# Altium schematic sheet FT4232H-USB to UART.SchDoc
size A3
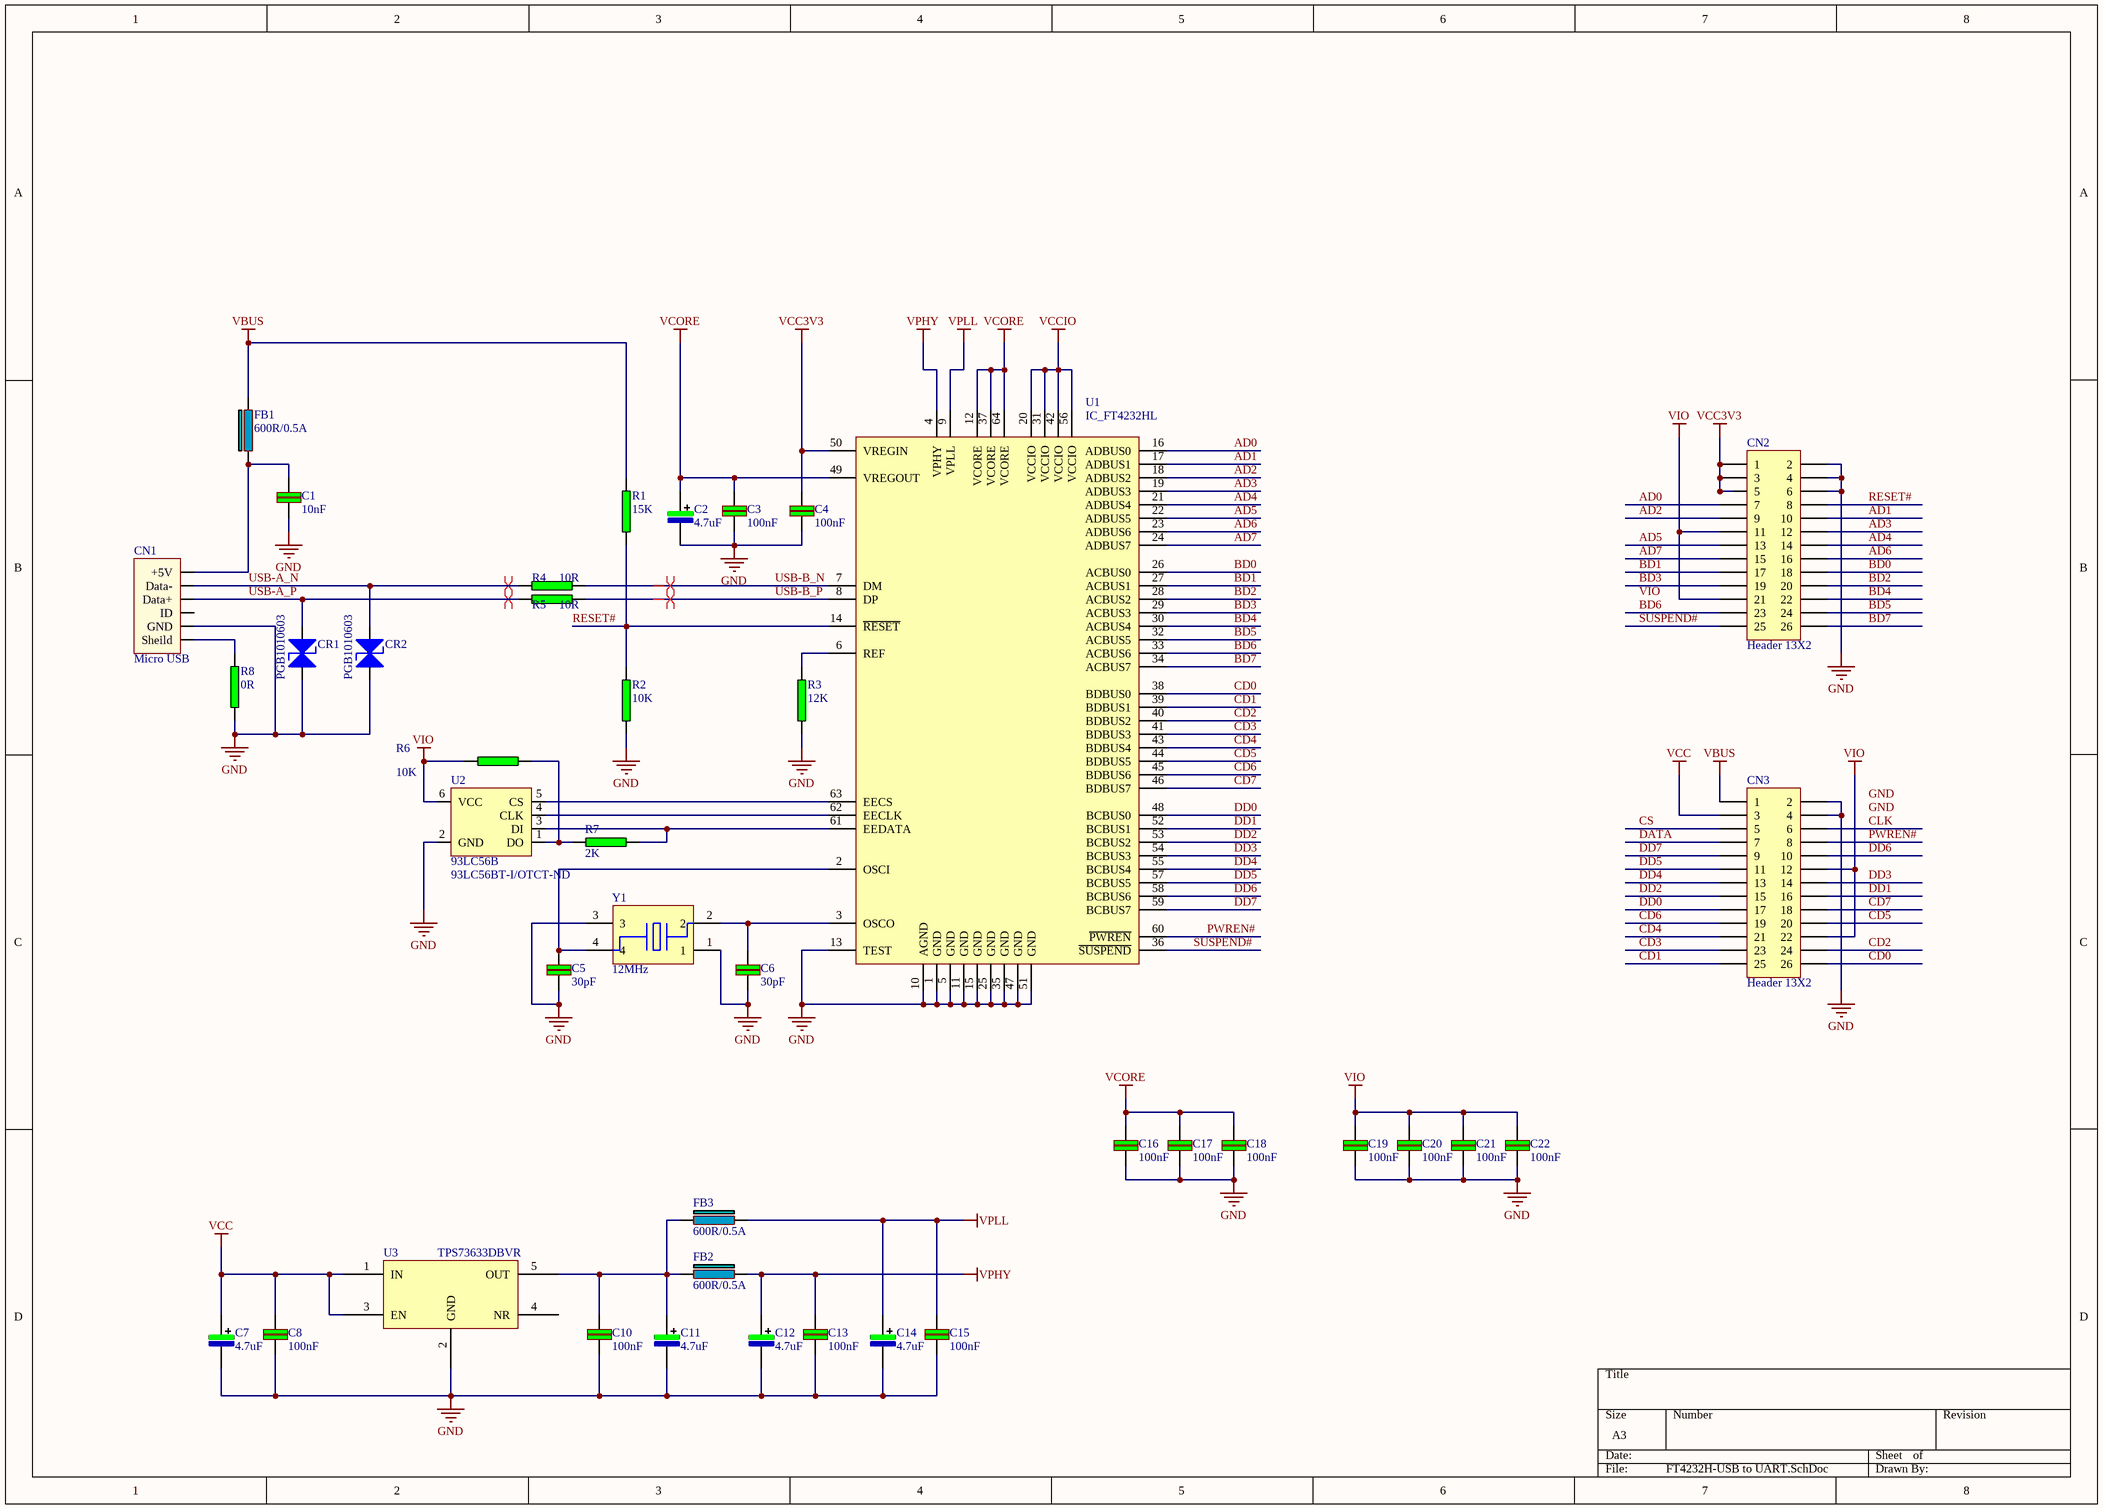
[diagram p0: FT4232H-USB to UART.SchDoc]

## Parts
C1  10nF  [C0402(1005)]
C2  4.7uF  [TANT_C1206(3216)]
C3  100nF  [C0402(1005)]
C4  100nF  [C0402(1005)]
C5  30pF  [C0402(1005)]
C6  30pF  [C0402(1005)]
C7  4.7uF  [TANT_C1206(3216)]
C8  100nF  [C0402(1005)]
C10  100nF  [C0402(1005)]
C11  4.7uF  [TANT_C1206(3216)]
C12  4.7uF  [TANT_C1206(3216)]
C13  100nF  [C0402(1005)]
C14  4.7uF  [TANT_C1206(3216)]
C15  100nF  [C0402(1005)]
C16  100nF  [C0402(1005)]
C17  100nF  [C0402(1005)]
C18  100nF  [C0402(1005)]
C19  100nF  [C0402(1005)]
C20  100nF  [C0402(1005)]
C21  100nF  [C0402(1005)]
C22  100nF  [C0402(1005)]
CN1  Micro USB  [MINI_USB]
CN2  Header 13X2  [Pin Header 2x13 TH Pitch 2.54mm]
CN3  Header 13X2  [Pin Header 2x13 TH Pitch 2.54mm]
CR1  PGB1010603  [R0603(1608)]
CR2  PGB1010603  [R0603(1608)]
FB1  600R/0.5A  [R0603(1608)]
FB2  600R/0.5A  [R0603(1608)]
FB3  600R/0.5A  [R0603(1608)]
R1  15K  [R0402(1005)]
R2  10K  [R0402(1005)]
R3  12K  [R0402(1005)]
R4  10R  [R0402(1005)]
R5  10R  [R0402(1005)]
R6  10K  [R0402(1005)]
R7  2K  [R0402(1005)]
R8  0R  [R0402(1005)]
U1  IC_FT4232HL  [LQFP-64]
U2  93LC56B  Supplier Part Number 1: 93LC56BT-I/OTCT-ND  [SOT23-6]
U3  TPS73633DBVR  [SOT23-5]
Y1  12MHz  [XTAL_8Y]

## Nets
GND: C1.2 C2.2 C3.2 C4.2 C5.2 C6.2 C7.2 C8.2 C10.2 C11.2 C12.2 C13.2 C14.2 C15.2 C16.2 C17.2 C18.2 C19.2 C20.2 C21.2 C22.2 CN1.5(GND) CN2.2 CN2.4 CN2.6 CN3.2 CN3.4 CR1.2(A) CR2.2(A) R2.1 R3.1 R8.1 U1.1(GND) U1.5(GND) U1.10(AGND) U1.11(GND) U1.13(TEST) U1.15(GND) U1.25(GND) U1.35(GND) U1.47(GND) U1.51(GND) U2.2(GND) U3.2(GND) Y1.1 Y1.3
VBUS: CN3.1 FB1.2 R1.2
VCC: C7.1 C8.1 CN3.3 U3.1(IN) U3.3(EN)
VCC3V3: C4.1 CN2.1 CN2.3 CN2.5 U1.50(VREGIN)
VCCIO: U1.20(VCCIO) U1.31(VCCIO) U1.42(VCCIO) U1.56(VCCIO)
VCORE: C2.1 C3.1 C16.1 C17.1 C18.1 U1.12(VCORE) U1.37(VCORE) U1.49(VREGOUT) U1.64(VCORE)
VIO: C19.1 C20.1 C21.1 C22.1 CN2.11 CN2.21 CN3.12 CN3.22 R6.2 U2.6(VCC)
VPHY: C12.1 C13.1 FB2.2 U1.4(VPHY)
VPLL: C14.1 C15.1 FB3.2 U1.9(VPLL)
AD0: CN2.7 U1.16(ADBUS0)
AD1: CN2.10 U1.17(ADBUS1)
AD2: CN2.9 U1.18(ADBUS2)
AD3: CN2.12 U1.19(ADBUS3)
AD4: CN2.14 U1.21(ADBUS4)
AD5: CN2.13 U1.22(ADBUS5)
AD6: CN2.16 U1.23(ADBUS6)
AD7: CN2.15 U1.24(ADBUS7)
BD0: CN2.18 U1.26(ACBUS0)
BD1: CN2.17 U1.27(ACBUS1)
BD2: CN2.20 U1.28(ACBUS2)
BD3: CN2.19 U1.29(ACBUS3)
BD4: CN2.22 U1.30(ACBUS4)
BD5: CN2.24 U1.32(ACBUS5)
BD6: CN2.23 U1.33(ACBUS6)
BD7: CN2.26 U1.34(ACBUS7)
CD0: CN3.26 U1.38(BDBUS0)
CD1: CN3.25 U1.39(BDBUS1)
CD2: CN3.24 U1.40(BDBUS2)
CD3: CN3.23 U1.41(BDBUS3)
CD4: CN3.21 U1.43(BDBUS4)
CD5: CN3.20 U1.44(BDBUS5)
CD6: CN3.19 U1.45(BDBUS6)
CD7: CN3.18 U1.46(BDBUS7)
CLK: CN3.6
CS: CN3.5
DATA: CN3.7
DD0: CN3.17 U1.48(BCBUS0)
DD1: CN3.16 U1.52(BCBUS1)
DD2: CN3.15 U1.53(BCBUS2)
DD3: CN3.14 U1.54(BCBUS3)
DD4: CN3.13 U1.55(BCBUS4)
DD5: CN3.11 U1.57(BCBUS5)
DD6: CN3.10 U1.58(BCBUS6)
DD7: CN3.9 U1.59(BCBUS7)
PWREN#: CN3.8 U1.60(~{PWREN})
RESET#: CN2.8 R1.1 R2.2 U1.14(~{RESET})
SUSPEND#: CN2.25 U1.36(~{SUSPEND})
USB-A_N: CN1.2(Data-) CR2.1(K) R4.1
USB-A_P: CN1.3(Data+) CR1.1(K) R5.1
USB-B_N: R4.2 U1.7(DM)
USB-B_P: R5.2 U1.8(DP)
NetC1_1: C1.1 CN1.1(+5V) FB1.1
NetC5_1: C5.1 U1.2(OSCI) Y1.4
NetC6_1: C6.1 U1.3(OSCO) Y1.2
NetC10_1: C10.1 C11.1 FB2.1 FB3.1 U3.5(OUT)
NetCN1_6: CN1.6(Sheild) R8.2
NetR3_2: R3.2 U1.6(REF)
NetR6_1: R6.1 R7.2 U2.1(DO)
NetR7_1: R7.1 U1.61(EEDATA) U2.3(DI)
NetU1_62: U1.62(EECLK) U2.4(CLK)
NetU1_63: U1.63(EECS) U2.5(CS)

Not connected (* = marked no-connect by the designer): CN1 4(ID); U3 4(NR)

## Layout directives
differential pair; rule Differential Pairs Routing [Pref Gap = 0.2mm    Min Gap  = 0.2mm    Max Gap  = 0.2mmPref Width = 0.2mm    Min Width  = 0.2mm    Max Width  = 0.2mm]: USB-A_N, USB-A_P, USB-B_N, USB-B_P

## Notes on the sheet
- Labels drawn without touching a wire or pin: GND, VIO

## Library data of the parts
C1 C3-C6 C8 C10 C13 C15-C22 = CAP: Capacitor
C2 C7 C11 C12 C14 = ELECTRO: Tantalum Capacitor
CN1 = 280024: Micro USB Connector
CN2 CN3 = Header 13X2: Header, 13-Pin, Dual row; LatestRevisionDate: 17-Jul-2002; LatestRevisionNote: Re-released for DXP Platform.; Publisher: Altium Limited
CR1 CR2 = 266170: TVS DIODE 24VWM 150VC 0603; Manufacturer: Littelfuse Inc.; Manufacturer Part Number: PGB1010603MR; Type: Zener; Bidirectional Channels: 1; Voltage - Reverse Standoff (Typ): 24V; Voltage - Clamping (Max) @ Ipp: 150V (Typ); Power Line Protection: No; Supplier 1: Digi-Key; Supplier Part Number 1: F2594CT-ND; RoHS: RoHS Compliant; Category: Circuit Protection; Stock 1: 142509; Pricing 1: 1=0.68, 10=0.577, 25=0.5048, 100=0.4326, 250=0.37492, 500=0.31724 (USD); Packaging: Cut Tape (CT); Part Status: Active; Unidirectional Channels: -; Voltage - Breakdown (Min): -; Current - Peak Pulse (10/1000µs): -; Power - Peak Pulse: -; Applications: General Purpose; Capacitance @ Frequency: -; Operating Temperature: -65°C ~ 125°C (TJ); Mounting Type: Surface Mount; Package / Case: 0603 (1608 Metric); Supplier Device Package: 0603 (1608 Metric); ComponentLink1URL: http://www.littelfuse.com/data/en/data_sheets/littelfuse_pulseguard-esd_pgb1.pdf; ComponentLink1Description: http://www.littelfuse.com/data/en/data_sheets/littelfuse_pulseguard-esd_pgb1.pdf
FB1-FB3 = L TYPE 1: Ferrite Bead
R1-R8 = RES2: Resistor
U1 = IC_FT4232HL: Quad High Speed USB to Multipurpose UART/MPSSE; Manufacturer: *; Note: *; ManufacturerPartNo: *
U2 = 93LC56B: IC EEPROM 2KBIT 2MHZ SOT23-6; Manufacturer: Microchip Technology; Manufacturer Part Number: 93LC56BT-I/OT; Format - Memory: EEPROMs - Serial; Memory Size: 2K (128 x 16); Interface: Microwire, 3-Wire Serial; Voltage - Supply: 2.5 V ~ 5.5 V; Supplier 1: Digi-Key; RoHS: RoHS Compliant; Category: Integrated Circuits (ICs); Stock 1: 6938; Pricing 1: 1=0.23, 25=0.2164, 100=0.2119 (USD); Packaging: Cut Tape (CT); Part Status: Active; Memory Type: EEPROM; Speed: 2MHz; Operating Temperature: -40°C ~ 85°C (TA); Package / Case: SOT-23-6; Supplier Device Package: SOT-23-6; ComponentLink1URL: http://www.microchip.com/mymicrochip/filehandler.aspx?ddocname=en013939; ComponentLink1Description: http://www.microchip.com/mymicrochip/filehandler.aspx?ddocname=en013939
U3 = TPS736XX: IC REG LDO 3.3V 0.4A SOT23-5
Y1 = XTAL: XTAL  7S